# Altium schematic sheet Main.SchDoc
size A4
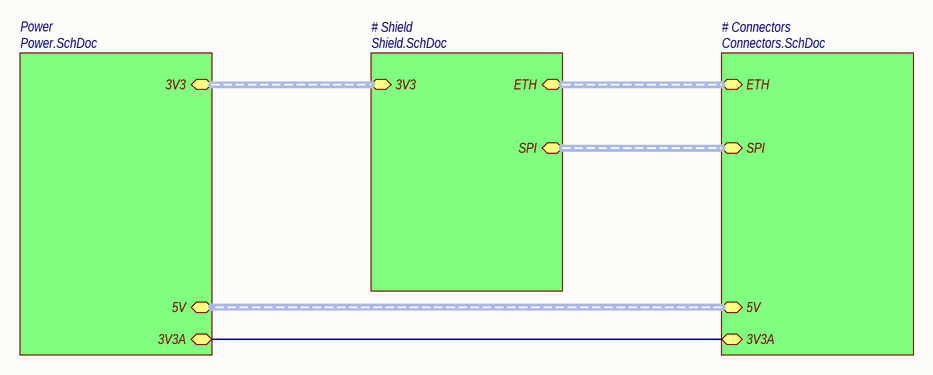
[diagram p0: Main.SchDoc]

## Sub-sheets
# Connectors = Connectors.SchDoc: ETH (harness ETH), SPI (harness SPI), 5V (harness Power_5V0), 3V3A
# Shield = Shield.SchDoc: ETH (harness ETH), SPI (harness SPI), 3V3 (harness Power_3V3)
Power = Power.SchDoc: 3V3 (harness Power_3V3), 5V (harness Power_5V0), 3V3A

## Nets
(unnamed): sheet # Connectors/3V3A, sheet Power/3V3A

## Buses and harness runs
harness sheet # Connectors/5V = sheet Power/5V
harness sheet # Connectors/ETH = sheet # Shield/ETH
harness sheet # Connectors/SPI = sheet # Shield/SPI
harness sheet # Shield/3V3 = sheet Power/3V3

## Notes on the sheet
- Title
- Size:
- Date:
- A4
- Number:
- Time:
- Revision:
- Sheet
- of
- File: